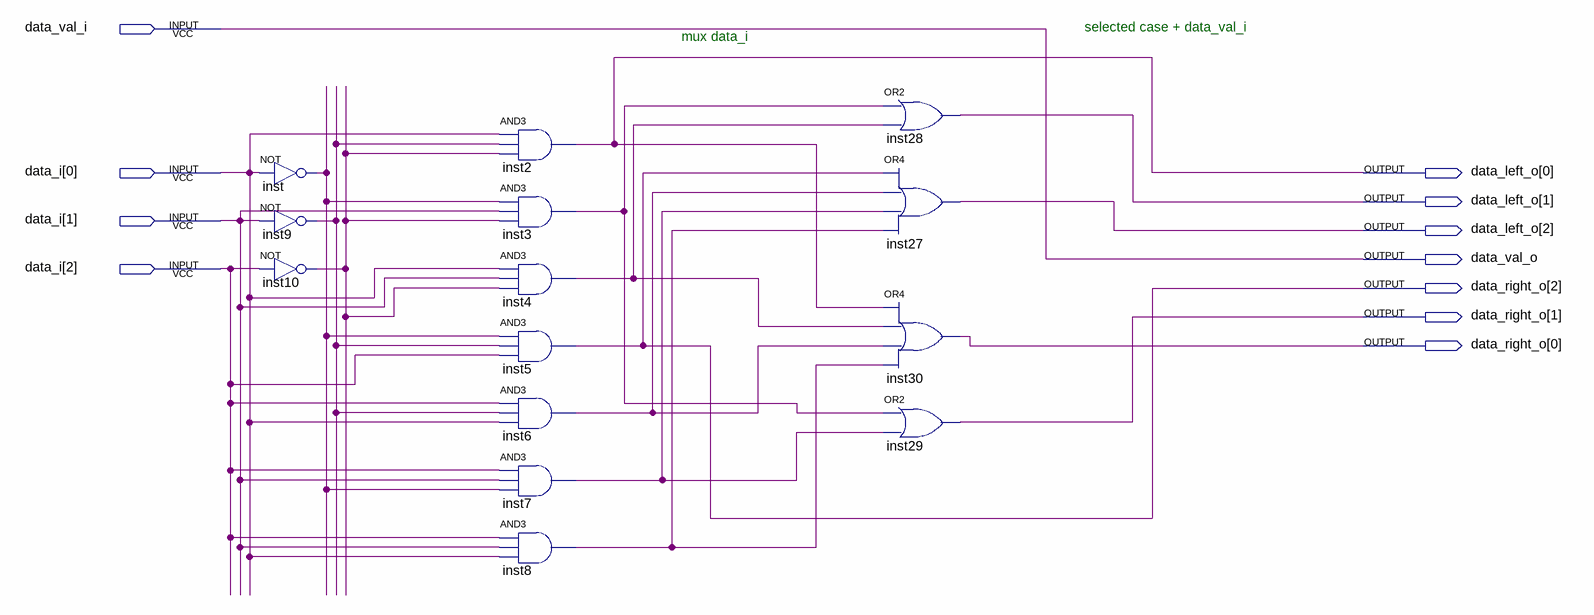
[diagram p0: schematic sheet]
// Quartus schematic priority_encoder_3.bdf as structural Verilog: 14 symbols, 11 pins
module priority_encoder_3 (
  input  data_val_i,
  input  [2:0] data_i,
  output [2:0] data_left_o,
  output data_val_o,
  output [2:0] data_right_o
);

  wire inst3_out, inst4_out, inst6_out, inst7_out, inst8_out, inst9_out, inst10_out, inst_out;

  not inst (inst_out, data_i[0]);
  not inst9 (inst9_out, data_i[1]);
  not inst10 (inst10_out, data_i[2]);
  and inst2 (data_left_o[0], data_i[0], inst9_out, inst10_out);
  and inst3 (inst3_out, inst_out, data_i[1], inst10_out);
  and inst4 (inst4_out, data_i[0], data_i[1], inst10_out);
  and inst5 (data_right_o[2], inst_out, inst9_out, data_i[2]);
  and inst6 (inst6_out, data_i[2], inst9_out, data_i[0]);
  and inst7 (inst7_out, data_i[2], data_i[1], inst_out);
  and inst8 (inst8_out, data_i[2], data_i[1], data_i[0]);
  or inst28 (data_left_o[1], inst3_out, inst4_out);
  or inst27 (data_left_o[2], data_right_o[2], inst6_out, inst7_out, inst8_out);
  or inst30 (data_right_o[0], data_left_o[0], inst4_out, inst6_out, inst8_out);
  or inst29 (data_right_o[1], inst3_out, inst7_out);

  assign data_val_o = data_val_i;

  // Notes on the sheet:
  //   selected case + data_val_i
  //   mux data_i
endmodule
